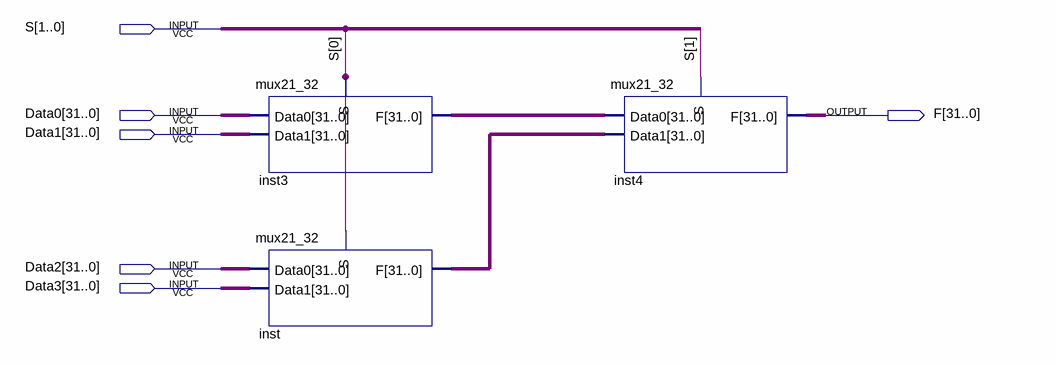
[diagram p0: schematic sheet]
// Quartus schematic mux41_32.bdf as structural Verilog: 3 symbols, 6 pins
module mux41_32 (
  input  [1:0] S,
  input  [31:0] Data0,
  input  [31:0] Data1,
  input  [31:0] Data2,
  input  [31:0] Data3,
  output [31:0] F
);

  wire [31:0] inst3_f, inst_f;

  mux21_32 inst3 (.Data0(Data0), .Data1(Data1), .S(S[0]), .F(inst3_f));
  mux21_32 inst (.Data0(Data2), .Data1(Data3), .S(S[0]), .F(inst_f));
  mux21_32 inst4 (.Data0(inst3_f), .Data1(inst_f), .S(S[1]), .F(F));
endmodule
